# Altium project CTDSP.PrjPcb
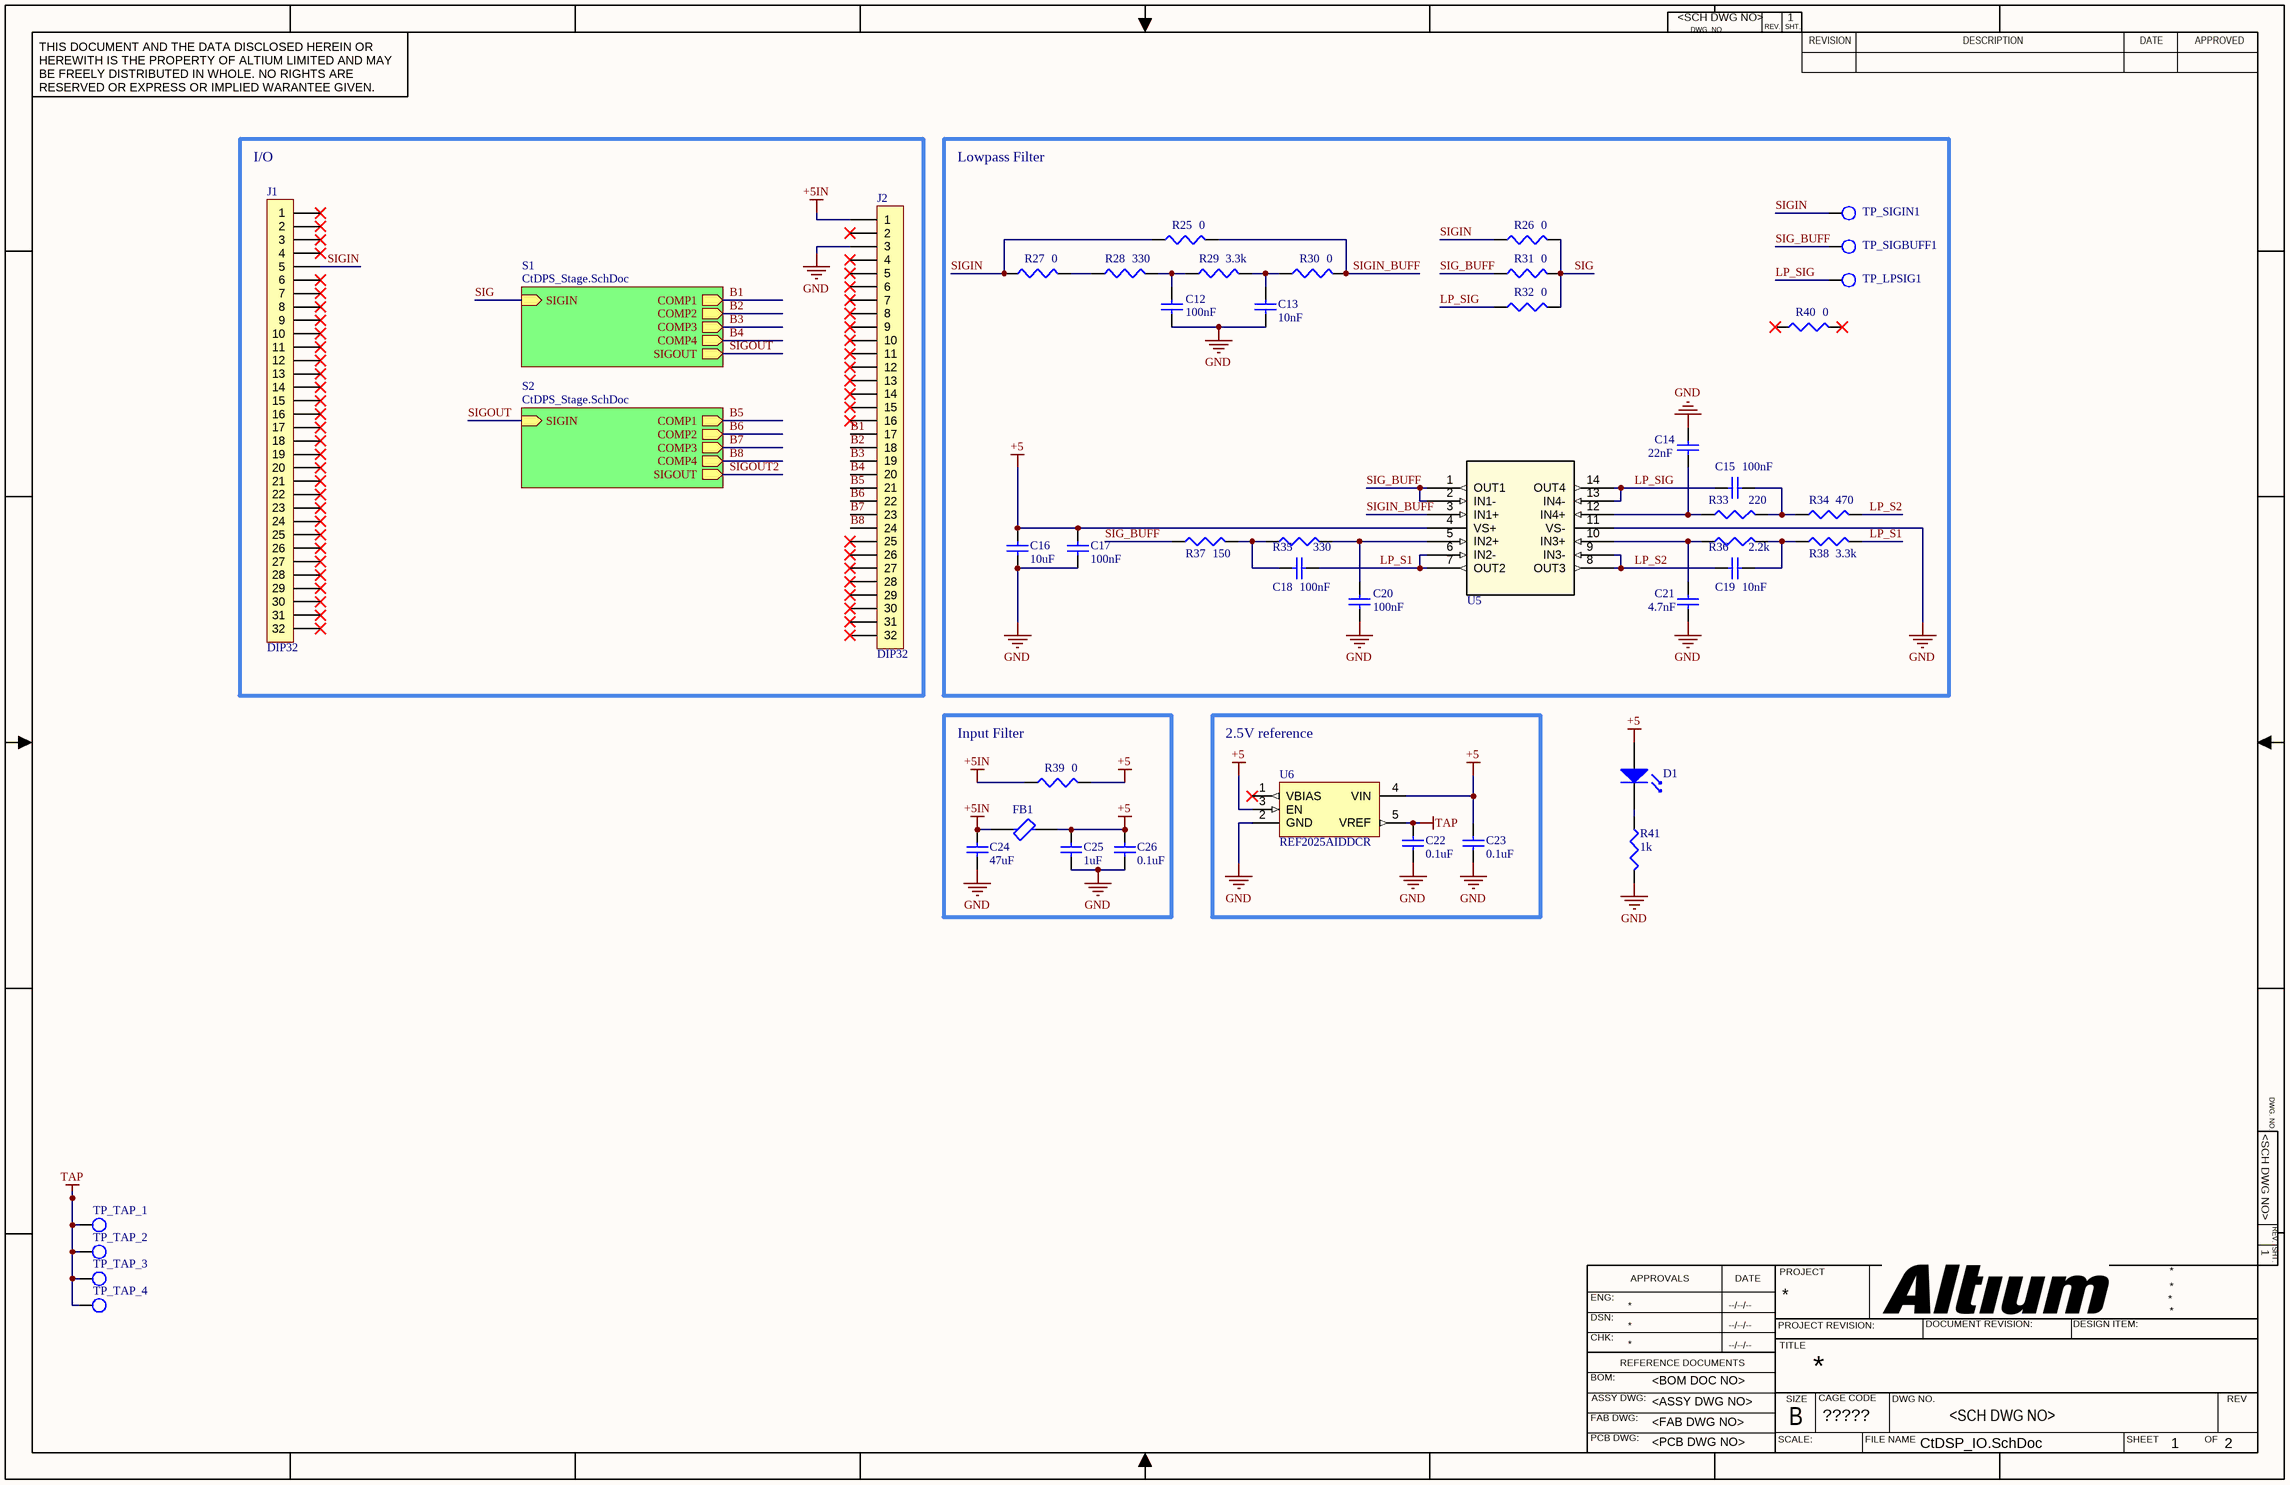
[diagram p0: CtDSP_IO.SchDoc]
CAGE_CODE: ?????; CONTRACT_NUMBER: <CONTRACT NO>; DOC_NO_ASSY_DWG: <ASSY DWG NO>; DOC_NO_BOM: <BOM DOC NO>; DOC_NO_FAB_DWG: <FAB DWG NO>; DOC_NO_SCH_DWG: <SCH DWG NO>; PCB_2_DEC_TOL: +/-.01; PCB_3_DEC_TOL: +/-.010; PCB_ANG_TOL: +/-1/2; PCB_ASSEMBLY_NO: <PCB ASSY NO>; PCB_CHECKER: - -----; PCB_CHECKER_APP_DATE: --/--/----; PCB_DESIGNER: - -----; PCB_DESIGNER_APP_DATE: --/--/----; PCB_DWG_NO: <PCB DWG NO>; PCB_ENGINEER: - -----; PCB_ENGINEER_APP_DATE: --/--/----; PCB_PART_NUMBER: <PCB PN>; PCB_REV: A; SCH_REV: A
2 sheets, 139 parts. Net scope: hierarchical (ports join the sheet entries above them; power ports are global).
Board file: PCB1.PcbDoc
Sheets:
  CtDSP_IO.SchDoc
    S1 = CtDPS_Stage.SchDoc
    S2 = CtDPS_Stage.SchDoc

## Sheet CtDSP_IO.SchDoc
size 431 x 279 mm; SheetNumber: 1; SheetTotal: 2; ENG_APP_DATE: --/--/--; DSN_APP_DATE: --/--/--; CHK_APP_DATE: --/--/--

### Parts
C12  100nF  [C_0402]
C13  10nF  [C_0402]
C14  22nF  [C_0402]
C15  100nF  [C_0402]
C16  10uF  [C_0402]
C17  100nF  [C_0402]
C18  100nF  [C_0402]
C19  10nF  [C_0402]
C20  100nF  [C_0402]
C21  4.7nF  [C_0402]
C22  0.1uF  [C_0402]
C23  0.1uF  [C_0402]
C24  47uF  [C_0805]
C25  1uF  [C_0603]
C26  0.1uF  [C_0402]
D1  LED_0603  [LED_6003]  (value not drawn)
FB1  BLM18PG121SN1D  [BLM18PG121SN1D]  (value not drawn)
J1  DIP32  [DIP32]
J2  DIP32  [DIP32]
R25  0  [RES_1206]
R26  0  [RES_1206]
R27  0  [RES_1206]
R28  330  [RES_0603]
R29  3.3k  [RES_0603]
R30  0  [RES_1206]
R31  0  [RES_1206]
R32  0  [RES_1206]
R33  220  [RES_0402]
R34  470  [RES_0402]
R35  330  [RES_0603]
R36  2.2k  [RES_0603]
R37  150  [RES_0603]
R38  3.3k  [RES_0603]
R39  0  [RES_1206]
R40  0  [RES_1206]
R41  1k  [RES_0402]
TP_LPSIG1  TESTPOINT  [TESTPOINT]  (value not drawn)
TP_SIGBUFF1  TESTPOINT  [TESTPOINT]  (value not drawn)
TP_SIGIN1  TESTPOINT  [TESTPOINT]  (value not drawn)
TP_TAP_1  TESTPOINT  [TESTPOINT]  (value not drawn)
TP_TAP_2  TESTPOINT  [TESTPOINT]  (value not drawn)
TP_TAP_3  TESTPOINT  [TESTPOINT]  (value not drawn)
TP_TAP_4  TP_TAP_4  [TESTPOINT]  (value not drawn)
U5  ADA4891-4ARZ-R7  [ADA4891-4ARZ-R7]  (value not drawn)
U6  REF2025AIDDCR  [REF2025AIDDCR]

### Blocks framed on the sheet
I/O: J1 J2
Lowpass Filter: C12-C21 R25-R38 R40 TP_LPSIG1 TP_SIGBUFF1 TP_SIGIN1 U5
Input Filter: C24-C26 FB1 R39
2.5V reference: C22 C23 U6

### Sub-sheets
S1 = CtDPS_Stage.SchDoc: SIGIN (in), COMP1 (out), COMP2 (out), COMP3 (out), COMP4 (out), SIGOUT (out)
S2 = CtDPS_Stage.SchDoc: SIGIN (in), COMP1 (out), COMP2 (out), COMP3 (out), COMP4 (out), SIGOUT (out)

### Nets
+5: C16.1 C17.2 C23.1 C25.2 C26.1 D1.2(K) FB1.2 R39.2 U5.4(VS+) U6.3(EN) U6.4(VIN)
+5IN: C24.2 FB1.1 J2.1 R39.1
GND: C12.1 C13.1 C14.2 C16.2 C17.1 C20.1 C21.1 C22.2 C23.2 C24.1 C25.1 C26.2 J2.3 R41.2 U5.11(VS-) U6.2(GND)
TAP: C22.1 TP_TAP_1.1 TP_TAP_2.1 TP_TAP_3.1 TP_TAP_4.1 U6.5(VREF)
B1: J2.17 ; sheet S1/COMP1
B2: J2.18 ; sheet S1/COMP2
B3: J2.19 ; sheet S1/COMP3
B4: J2.20 ; sheet S1/COMP4
B5: J2.21 ; sheet S2/COMP1
B6: J2.22 ; sheet S2/COMP2
B7: J2.23 ; sheet S2/COMP3
B8: J2.24 ; sheet S2/COMP4
LP_S1: C18.1 R38.2 U5.6(IN2-) U5.7(OUT2)
LP_S2: C19.1 R34.2 U5.8(OUT3) U5.9(IN3-)
LP_SIG: C15.2 R32.1 TP_LPSIG1.1 U5.13(IN4-) U5.14(OUT4)
SIG: R26.2 R31.2 R32.2 ; sheet S1/SIGIN
SIG_BUFF: R31.1 R37.1 TP_SIGBUFF1.1 U5.1(OUT1) U5.2(IN1-)
SIGIN: J1.5 R25.1 R26.1 R27.1 TP_SIGIN1.1
SIGIN_BUFF: R25.2 R30.2 U5.3(IN1+)
SIGOUT: sheet S1/SIGOUT, sheet S2/SIGIN  [project net SIG1]
NetC12_2: C12.2 R28.2 R29.1
NetC13_2: C13.2 R29.2 R30.1
NetC14_1: C14.1 R33.1 U5.12(IN4+)
NetC15_1: C15.1 R33.2 R34.1
NetC18_2: C18.2 R35.1 R37.2
NetC19_2: C19.2 R36.2 R38.1
NetC20_2: C20.2 R35.2 U5.5(IN2+)
NetC21_2: C21.2 R36.1 U5.10(IN3+)
NetD1_1: D1.1(A) R41.1
NetR27_2: R27.2 R28.1

Not connected (* = marked no-connect by the designer): J1 1* 2* 3* 4* 6* 7* 8* 9* 10* 11* 12* 13* 14* 15* 16* 17* 18* 19* 20* 21* 22* 23* 24* 25* 26* 27* 28* 29* 30* 31* 32*; J2 2* 4* 5* 6* 7* 8* 9* 10* 11* 12* 13* 14* 15* 16* 25* 26* 27* 28* 29* 30* 31* 32*; R40 1* 2*; U6 1(VBIAS)*

### Notes on the sheet
- DWG. NO.
- REV.
- SHT.
- THIS DOCUMENT AND THE DATA DISCLOSED HEREIN OR HEREWITH IS THE PROPERTY OF ALTIUM LIMITED AND MAY BE FREELY DISTRIBUTED IN WHOLE. NO RIGHTS ARE RESERVED OR EXPRESS OR IMPLIED WARANTEE GIVEN.
- REVISION
- DESCRIPTION
- DATE
- APPROVED
- ENG:
- APPROVALS
- PROJECT
- DSN:
- CHK:
- REFERENCE DOCUMENTS
- PROJECT REVISION:
- TITLE
- DOCUMENT REVISION:
- DESIGN ITEM:
- BOM:
- FAB DWG:
- PCB DWG:
- ASSY DWG:
- SCALE:
- SIZE
- B
- CAGE CODE
- FILE NAME
- DWG NO.
- SHEET
- OF
- REV

### Library data of the parts
C12-C23 C26 = C_0402
  C12 C15 C17 C18 C20 C22 C23 C26: LCSC Part #: C1525
  C13 C19: LCSC Part #: C15195
  C14: LCSC Part #: C1532
  C16: LCSC Part #: C15525
  C21: LCSC Part #: C1538
C24 = C_0805: LCSC Part #: C16780
C25 = C_0603: LCSC Part #: C15849
FB1 = BLM18PG121SN1D: -55℃~+125℃ 1 120Ω@100MHz 2A 50mΩ ±25% 0603 Ferrite Beads ROHS; LCSC Part #: C14709
R25-R27 R30-R32 R39 R40 = RES_1206: LCSC Part #: C17888
R28 R29 R35-R38 = RES_0603
  R28 R35: LCSC Part #: C23138
  R29 R38: LCSC Part #: C22978
  R36: LCSC Part #: C4190
  R37: LCSC Part #: C22808
R33 R34 R41 = RES_0402
  R33: LCSC Part #: C25091
  R34: LCSC Part #: C25117
  R41: LCSC Part #: C11702
TP_TAP_4 = TESTPOINT
U5 = ADA4891-4ARZ-R7: Quad Rail-to-Rail Op-Amp, 240 MHz, 170 V/µs, SOT-23-5; LCSC Part #: C654290
D1 = LED_0603: LCSC Part #: C2286
U6 = REF2025AIDDCR: LCSC Part #: C962078

## Sheet CtDPS_Stage.SchDoc
size B; SheetNumber: 2; SheetTotal: 2
Used 2 times, as channels S1, S2. Parts and nets are listed once, with the designators drawn on the sheet.
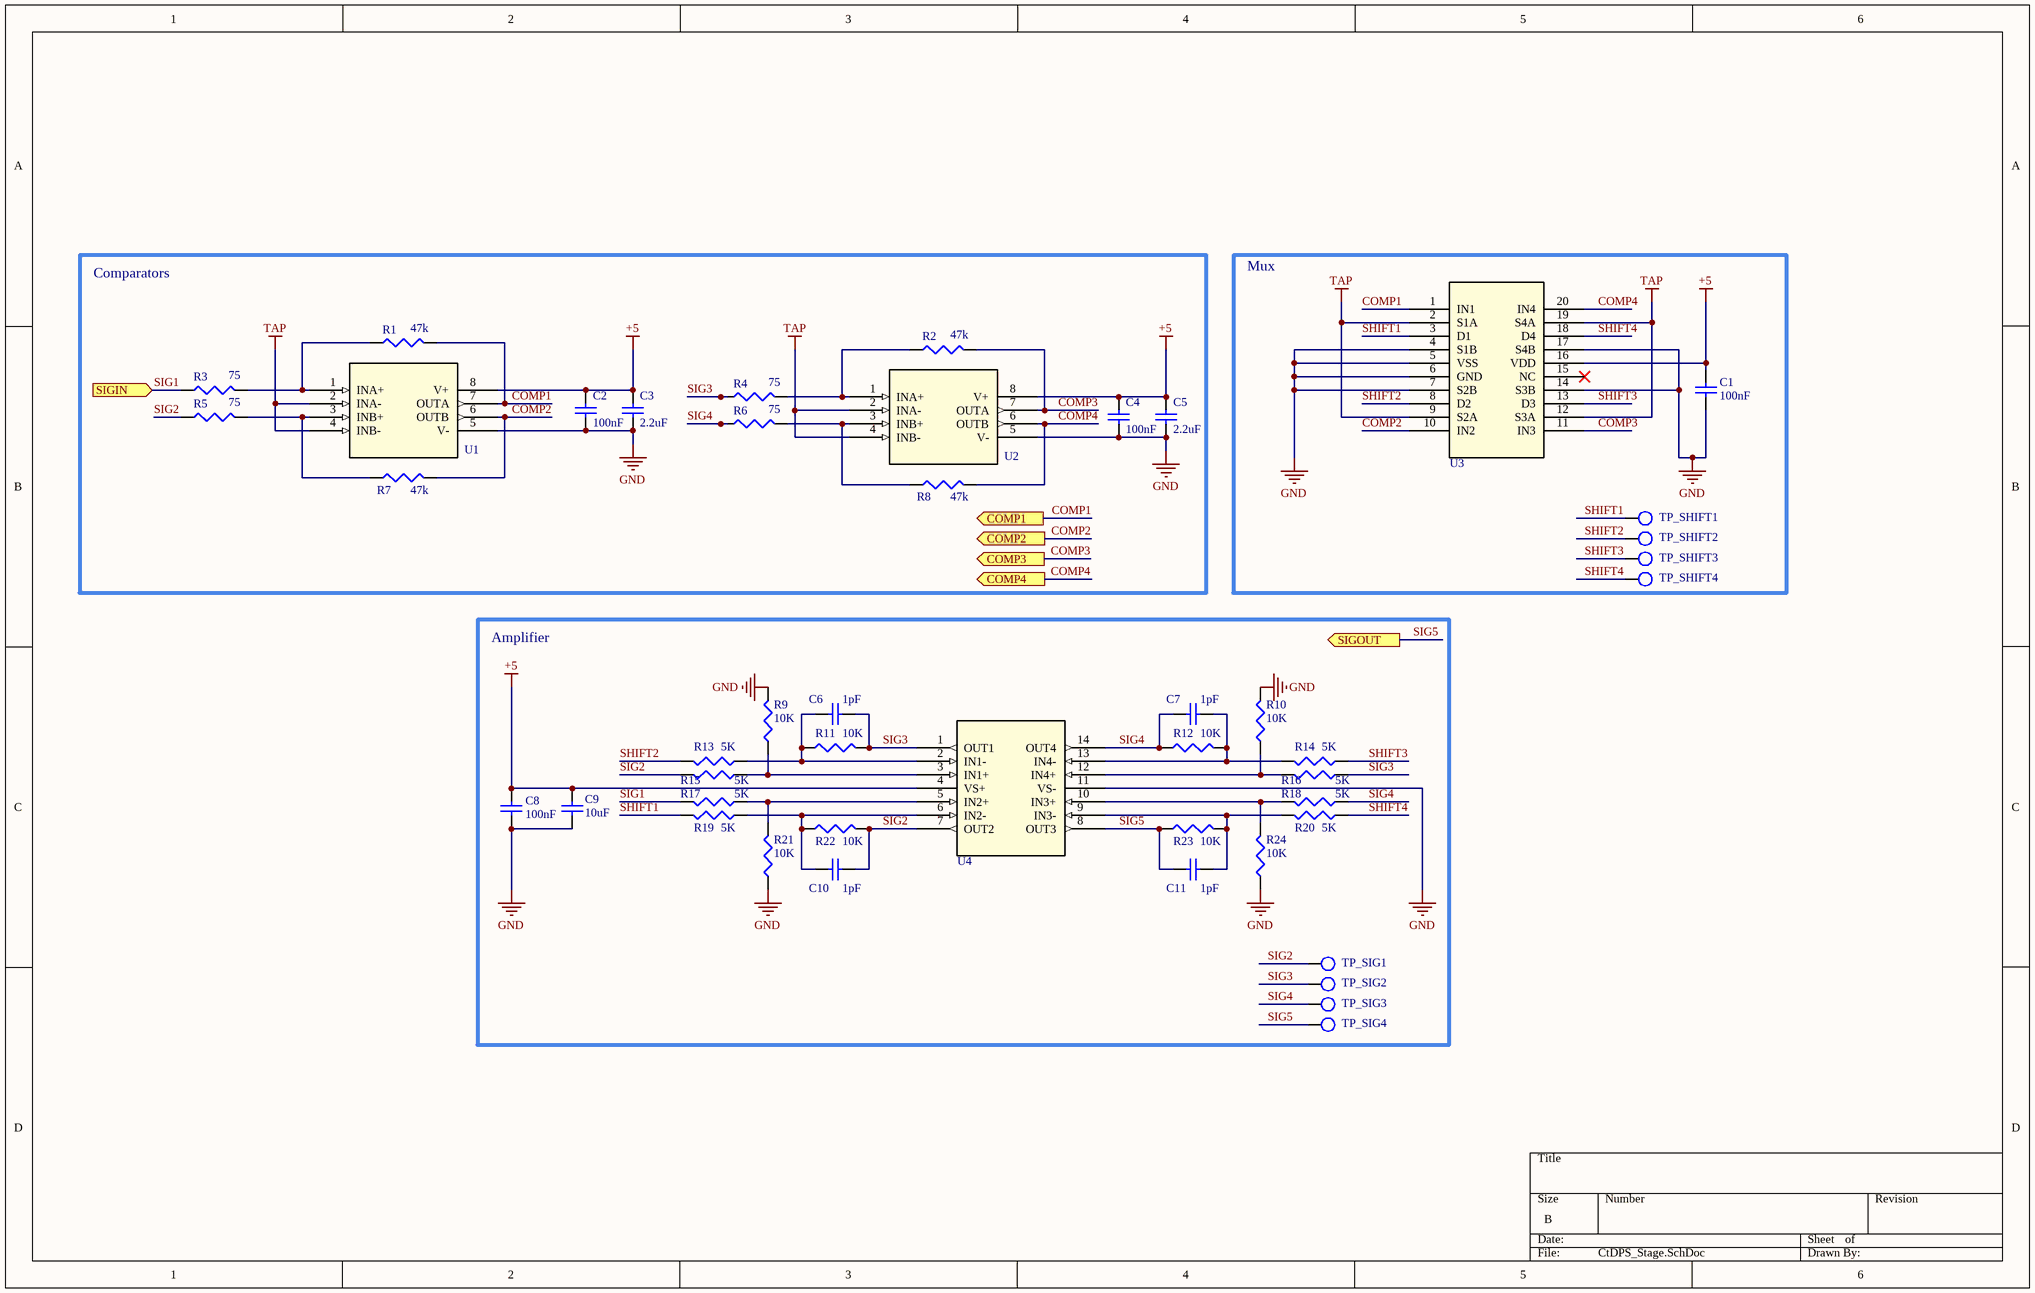
[diagram p1: CtDPS_Stage.SchDoc]

### Parts
C1  100nF  [C_0402]
C2  100nF  [C_0402]
C3  2.2uF  [C_0402]
C4  100nF  [C_0402]
C5  2.2uF  [C_0402]
C6  1pF  [C_0402]
C7  1pF  [C_0402]
C8  100nF  [C_0402]
C9  10uF  [C_0402]
C10  1pF  [C_0402]
C11  1pF  [C_0402]
R1  47k  [RES_0603]
R2  47k  [RES_0603]
R3  75  [RES_0603]
R4  75  [RES_0603]
R5  75  [RES_0603]
R6  75  [RES_0603]
R7  47k  [RES_0603]
R8  47k  [RES_0603]
R9  10K  [RES_0402]
R10  10K  [RES_0402]
R11  10K  [RES_0402]
R12  10K  [RES_0402]
R13  5K  [RES_0402]
R14  5K  [RES_0402]
R15  5K  [RES_0402]
R16  5K  [RES_0402]
R17  5K  [RES_0402]
R18  5K  [RES_0402]
R19  5K  [RES_0402]
R20  5K  [RES_0402]
R21  10K  [RES_0402]
R22  10K  [RES_0402]
R23  10K  [RES_0402]
R24  10K  [RES_0402]
TP_SHIFT1  TESTPOINT  [TESTPOINT]  (value not drawn)
TP_SHIFT2  TESTPOINT  [TESTPOINT]  (value not drawn)
TP_SHIFT3  TESTPOINT  [TESTPOINT]  (value not drawn)
TP_SHIFT4  TESTPOINT  [TESTPOINT]  (value not drawn)
TP_SIG1  TESTPOINT  [TESTPOINT]  (value not drawn)
TP_SIG2  TESTPOINT  [TESTPOINT]  (value not drawn)
TP_SIG3  TESTPOINT  [TESTPOINT]  (value not drawn)
TP_SIG4  TESTPOINT  [TESTPOINT]  (value not drawn)
U1  TLV3502AIDR  [TLV3502AIDR]  (value not drawn)
U2  TLV3502AIDR  [TLV3502AIDR]  (value not drawn)
U3  ADG734BRUZ-REEL  [ADG734BRUZ-REEL]  (value not drawn)
U4  ADA4891-4ARZ-R7  [ADA4891-4ARZ-R7]  (value not drawn)

### Blocks framed on the sheet
Comparators: C2-C5 R1-R8 U1 U2
Mux: C1 TP_SHIFT1-TP_SHIFT4 U3
Amplifier: C6-C11 R9-R24 TP_SIG1-TP_SIG4 U4

### Ports
COMP1 (out), COMP2 (out), COMP3 (out), COMP4 (out), SIGIN (in), SIGOUT (out)

### Nets
+5: C1.1 C2.1 C3.2 C4.1 C5.2 C8.1 C9.2 U1.8(V+) U2.8(V+) U3.16(VDD) U4.4(VS+)
GND: C1.2 C2.2 C3.1 C4.2 C5.1 C8.2 C9.1 R9.2 R10.2 R21.1 R24.1 U1.5(V-) U2.5(V-) U3.4(S1B) U3.5(VSS) U3.6(GND) U3.7(S2B) U3.14(S3B) U3.17(S4B) U4.11(VS-)
TAP: U1.2(INA-) U1.4(INB-) U2.2(INA-) U2.4(INB-) U3.2(S1A) U3.9(S2A) U3.12(S3A) U3.19(S4A)
COMP1: R1.2 U1.7(OUTA) U3.1(IN1) ; port COMP1
COMP2: R7.2 U1.6(OUTB) U3.10(IN2) ; port COMP2
COMP3: R2.2 U2.7(OUTA) U3.11(IN3) ; port COMP3
COMP4: R8.2 U2.6(OUTB) U3.20(IN4) ; port COMP4
SHIFT1: R19.1 TP_SHIFT1.1 U3.3(D1)
SHIFT2: R13.1 TP_SHIFT2.1 U3.8(D2)
SHIFT3: R14.2 TP_SHIFT3.1 U3.13(D3)
SHIFT4: R20.2 TP_SHIFT4.1 U3.18(D4)
SIG1: R3.1 R17.1 ; port SIGIN
SIG2: C10.2 R5.1 R15.1 R22.2 TP_SIG1.1 U4.7(OUT2)
SIG3: C6.2 R4.1 R11.2 R16.2 TP_SIG2.1 U4.1(OUT1)
SIG4: C7.1 R6.1 R12.1 R18.2 TP_SIG3.1 U4.14(OUT4)
SIG5: C11.1 R23.1 TP_SIG4.1 U4.8(OUT3) ; port SIGOUT
NetC6_1: C6.1 R11.1 R13.2 U4.2(IN1-)
NetC7_2: C7.2 R12.2 R14.1 U4.13(IN4-)
NetC10_1: C10.1 R19.2 R22.1 U4.6(IN2-)
NetC11_2: C11.2 R20.1 R23.2 U4.9(IN3-)
NetR1_1: R1.1 R3.2 U1.1(INA+)
NetR2_1: R2.1 R4.2 U2.1(INA+)
NetR5_2: R5.2 R7.1 U1.3(INB+)
NetR6_2: R6.2 R8.1 U2.3(INB+)
NetR9_1: R9.1 R15.2 U4.3(IN1+)
NetR10_1: R10.1 R16.1 U4.12(IN4+)
NetR17_2: R17.2 R21.2 U4.5(IN2+)
NetR18_1: R18.1 R24.2 U4.10(IN3+)

Not connected (* = marked no-connect by the designer): U3 15(NC)*

### Channels
S1: designators end in _S1; ports COMP1=B1 COMP2=B2 COMP3=B3 COMP4=B4 SIGIN=SIG SIGOUT=SIG1
S2: designators end in _S2; ports COMP1=B5 COMP2=B6 COMP3=B7 COMP4=B8 SIGIN=SIG1 SIGOUT=SIG5_S2

### Library data of the parts
C1-C11 = C_0402
  C1 C2 C4 C8: LCSC Part #: C1525
  C3 C5: LCSC Part #: C12530
  C6 C7 C10 C11: LCSC Part #: C1550
  C9: LCSC Part #: C15525
R1-R8 = RES_0603
  R1 R2 R7 R8: LCSC Part #: C25819
  R3-R6: LCSC Part #: C4275
R9-R24 = RES_0402
  R9-R12 R21-R24: LCSC Part #: C25744
  R13-R20: LCSC Part #: C5948099
U1 U2 = TLV3502AIDR: Dual 4.5ns Push-pull Rail-to-Rail Input, Rail-to-Rail Output TTL Comparators; LCSC Part #: C131165
U4 = ADA4891-4ARZ-R7: as U5 on sheet CtDSP_IO; LCSC Part #: C654290
U3 = ADG734BRUZ-REEL: LCSC Part #: C579105

## Nets that join several sheets
+5: CtDSP_IO (11 pins), S1 (11 pins), S2 (11 pins)
GND: CtDSP_IO (16 pins), S1 (20 pins), S2 (20 pins)
TAP: CtDSP_IO (6 pins), S1 (8 pins), S2 (8 pins)
B1: CtDSP_IO (J2.17), S1 (R1_S1.2 U1_S1.7 U3_S1.1)
B2: CtDSP_IO (J2.18), S1 (R7_S1.2 U1_S1.6 U3_S1.10)
B3: CtDSP_IO (J2.19), S1 (R2_S1.2 U2_S1.7 U3_S1.11)
B4: CtDSP_IO (J2.20), S1 (R8_S1.2 U2_S1.6 U3_S1.20)
B5: CtDSP_IO (J2.21), S2 (R1_S2.2 U1_S2.7 U3_S2.1)
B6: CtDSP_IO (J2.22), S2 (R7_S2.2 U1_S2.6 U3_S2.10)
B7: CtDSP_IO (J2.23), S2 (R2_S2.2 U2_S2.7 U3_S2.11)
B8: CtDSP_IO (J2.24), S2 (R8_S2.2 U2_S2.6 U3_S2.20)
SIG: CtDSP_IO (R26.2 R31.2 R32.2), S1 (R3_S1.1 R17_S1.1)
SIG1: S1 (C11_S1.1 R23_S1.1 TP_SIG4_S1.1 U4_S1.8), S2 (R3_S2.1 R17_S2.1)